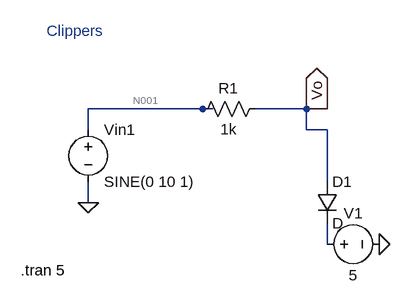
[diagram p0: schematic Diode_Clippers.asc]
Diode_Clippers.asc, the LTspice schematic file:
Version 4
SHEET 1 880 736
WIRE 272 464 96 464
WIRE 288 464 272 464
WIRE 432 464 352 464
WIRE 448 464 432 464
WIRE 464 464 448 464
WIRE 96 496 96 464
WIRE 432 496 432 464
WIRE 464 496 432 496
WIRE 464 576 464 496
WIRE 96 608 96 576
WIRE 464 672 464 640
FLAG 96 608 0
FLAG 448 464 Vo
IOPIN 448 464 Out
FLAG 544 672 0
SYMBOL voltage 96 480 R0
WINDOW 123 0 0 Left 0
WINDOW 39 0 0 Left 0
SYMATTR InstName Vin1
SYMATTR Value SINE(0 10 1)
SYMBOL diode 448 576 R0
SYMATTR InstName D1
SYMBOL voltage 448 672 R270
WINDOW 0 32 56 VTop 2
WINDOW 3 -32 56 VBottom 2
SYMATTR InstName V1
SYMATTR Value 5
SYMBOL res 368 448 R90
WINDOW 0 0 56 VBottom 2
WINDOW 3 32 56 VTop 2
SYMATTR InstName R1
SYMATTR Value 1k
TEXT 32 344 Left 2 ;Clippers
TEXT -8 712 Left 2 !.tran 5

The netlist it stands for:
* Diode_Clippers.asc
Vin1 N001 0 SINE(0 10 1)
D1 Vo N002 D
V1 N002 0 5
R1 Vo N001 1k
.model D D
.lib standard.dio
* Clippers
.tran 5
.backanno
.end

* Results of the author's LTspice run, read from the files saved beside the schematic
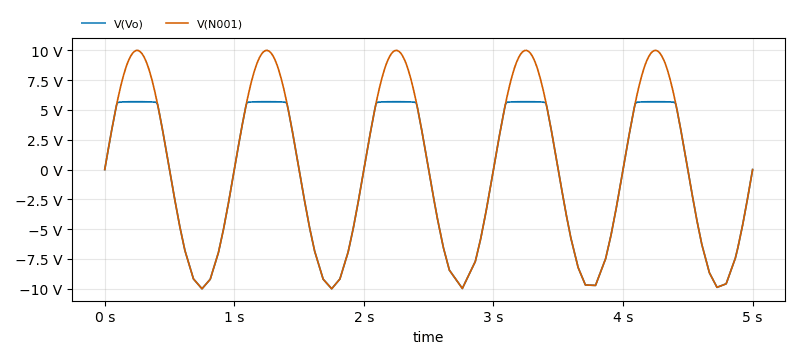
[diagram p1: Transient Analysis of Diode_Clippers.asc, plotted from the saved traces]
* Transient Analysis, 1 run:
*   V(Vo): min -9.998 V, max 5.693 V, average -830 mV, rms 6.052 V, last 0 V
*   V(N001): min -10 V, max 9.998 V, average 42.01 mV, rms 7.038 V, last 0 V